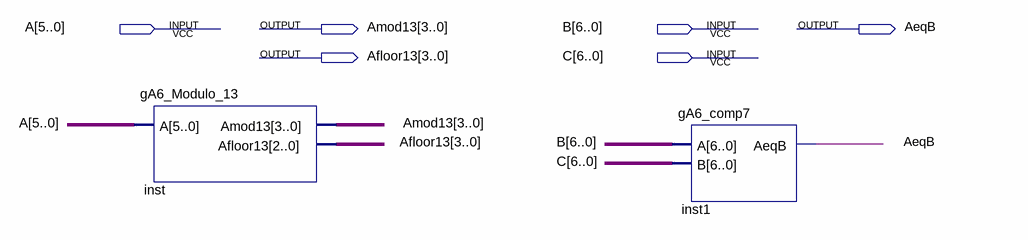
[diagram p0: schematic sheet]
// Quartus schematic gA6_lab1.bdf as structural Verilog: 2 symbols, 6 pins
module gA6_lab1 (
  input  [5:0] A,
  input  [6:0] B,
  input  [6:0] C,
  output [3:0] Amod13,
  output AeqB,
  output [3:0] Afloor13
);

  gA6_Modulo_13 inst (.A(A), .Amod13(Amod13), .Afloor13(Afloor13));
  gA6_comp7 inst1 (.A(B), .B(C), .AeqB(AeqB));
endmodule
